# Altium schematic sheet MAIN.SchDoc
size A4; Address1: 00-<Schema Name>; DocumentNumber: 1; SheetNumber: 1; SheetTotal: 5; ModifiedBy: -; Size: A4
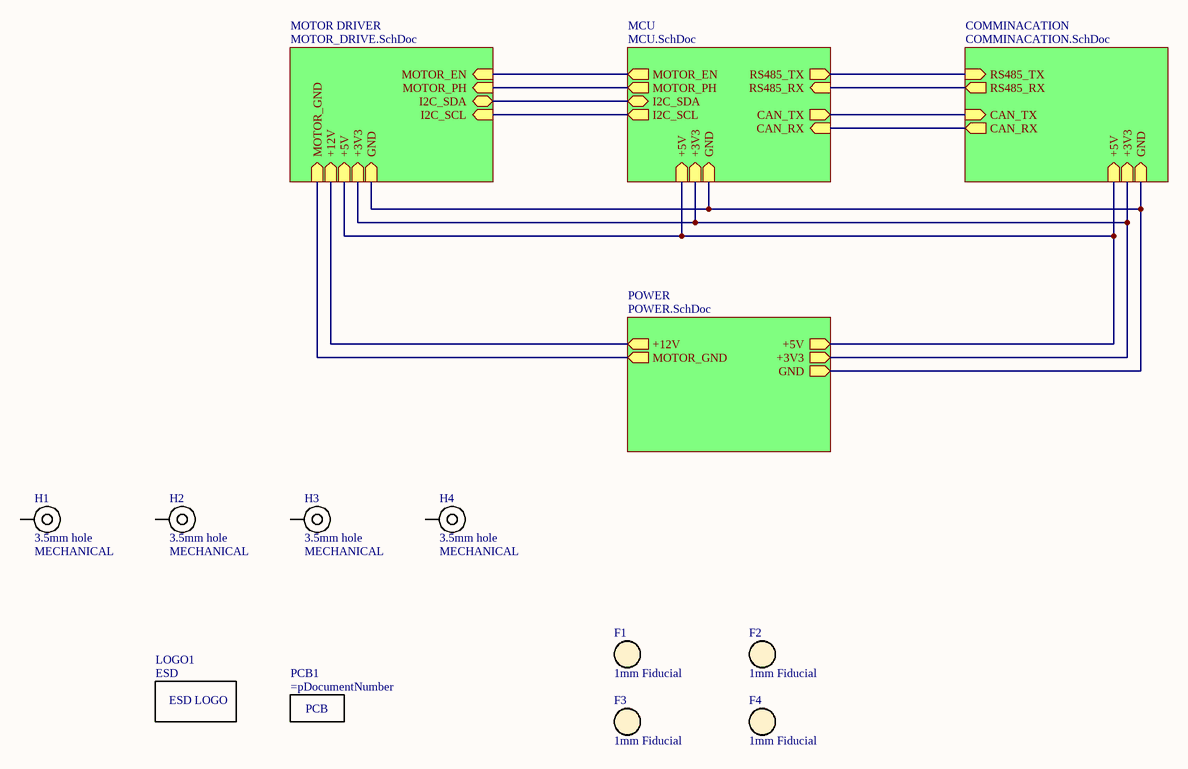
[diagram p0: MAIN.SchDoc]

## Parts
F1  1mm Fiducial  [1mm Fiducial]  (no BOM)
F2  1mm Fiducial  [1mm Fiducial]  (no BOM)
F3  1mm Fiducial  [1mm Fiducial]  (no BOM)
F4  1mm Fiducial  [1mm Fiducial]  (no BOM)
H1  3.5mm hole  Category: MECHANICAL  [3.5mm hole]  (no BOM)
H2  3.5mm hole  Category: MECHANICAL  [3.5mm hole]  (no BOM)
H3  3.5mm hole  Category: MECHANICAL  [3.5mm hole]  (no BOM)
H4  3.5mm hole  Category: MECHANICAL  [3.5mm hole]  (no BOM)
LOGO1  ESD  [ESD]
PCB1  (no value)  (mechanical)

## Sub-sheets
COMMINACATION = COMMINACATION.SchDoc: +5V (in), GND (in), +3V3 (in), RS485_TX (in), RS485_RX (out), CAN_TX (in), CAN_RX (out)
MCU = MCU.SchDoc: +3V3 (in), GND (in), +5V (in), RS485_TX (out), RS485_RX (in), CAN_TX (out), CAN_RX (in), MOTOR_EN (out), MOTOR_PH (out), I2C_SDA (bidir), I2C_SCL (out)
MOTOR DRIVER = MOTOR_DRIVE.SchDoc: +12V (in), MOTOR_GND (in), +3V3 (in), GND (in), +5V (in), MOTOR_EN (in), MOTOR_PH (in), I2C_SDA (bidir), I2C_SCL (in)
POWER = POWER.SchDoc: +12V (out), +5V (out), +3V3 (out), GND (out), MOTOR_GND (out)

## Nets
(unnamed): sheet MCU/+3V3, sheet COMMINACATION/+3V3, sheet POWER/+3V3, sheet MOTOR DRIVER/+3V3
(unnamed): sheet MCU/GND, sheet COMMINACATION/GND, sheet POWER/GND, sheet MOTOR DRIVER/GND
(unnamed): sheet MCU/+5V, sheet COMMINACATION/+5V, sheet POWER/+5V, sheet MOTOR DRIVER/+5V
(unnamed): sheet MCU/RS485_TX, sheet COMMINACATION/RS485_TX
(unnamed): sheet MCU/RS485_RX, sheet COMMINACATION/RS485_RX
(unnamed): sheet MCU/CAN_TX, sheet COMMINACATION/CAN_TX
(unnamed): sheet MCU/CAN_RX, sheet COMMINACATION/CAN_RX
(unnamed): sheet MCU/MOTOR_EN, sheet MOTOR DRIVER/MOTOR_EN
(unnamed): sheet MCU/MOTOR_PH, sheet MOTOR DRIVER/MOTOR_PH
(unnamed): sheet MCU/I2C_SDA, sheet MOTOR DRIVER/I2C_SDA
(unnamed): sheet MCU/I2C_SCL, sheet MOTOR DRIVER/I2C_SCL
(unnamed): sheet POWER/+12V, sheet MOTOR DRIVER/+12V
(unnamed): sheet POWER/MOTOR_GND, sheet MOTOR DRIVER/MOTOR_GND

Not connected (* = marked no-connect by the designer): H1 1; H2 1; H3 1; H4 1

## Notes on the sheet
- Tarih/Date
- Tasa/Desig
- Kont/Check
- Onay/Appr
- Sayfa/Sht
- Form
- Ortam/Env
- A4
- /
- Deg Tarihi/Chng Date
- Deg Onay/Chng Appr
- Rev
- (c) 2022 by SCSG Elektronik A.Ş.
  All rights Reserved. No part of this document may be produced or transmitted in any form or by any means electronic, mechanical, photocopying, recording, or otherwise, without prior written permission of SCSG.

## Library data of the parts
F1-F4 = 1mm Fiducial: Manufacturer Part Number: Fiducial 2mm; Purpose Of Usage: BASIC; Category: MECHANICAL; Sub-Category: FIDUCIAL; Manufacturer: --; Mount: NO MOUNT; Stock ID: ??; SAP Tanım: -
H1-H4 = 3.5mm hole: 3.5mm delik; Purpose Of Usage: BASIC; Sub-Category: HOLE; Manufacturer: --; Manufacturer Part Number: --; Mount: NO MOUNT; Stock ID: ??
LOGO1 = ESD: ESD LOGO; Category: Logo
PCB1 = PCB: Manufacturer: JLC; Purpose Of Usage: BASIC; Category: MECHANICAL; Local Supplier: CUSTOM; Manufacturer Part Number: =pDocumentNumber; Mount: MECH; Price 10K: 0.25; SAP Tanım: -; Stock ID: ??; Sub-Category: PCB; Supplier 1: CUSTOM; Supplier Part Number 1: CUSTOM